# EAGLE design basspre (EAGLE 6.6.0)
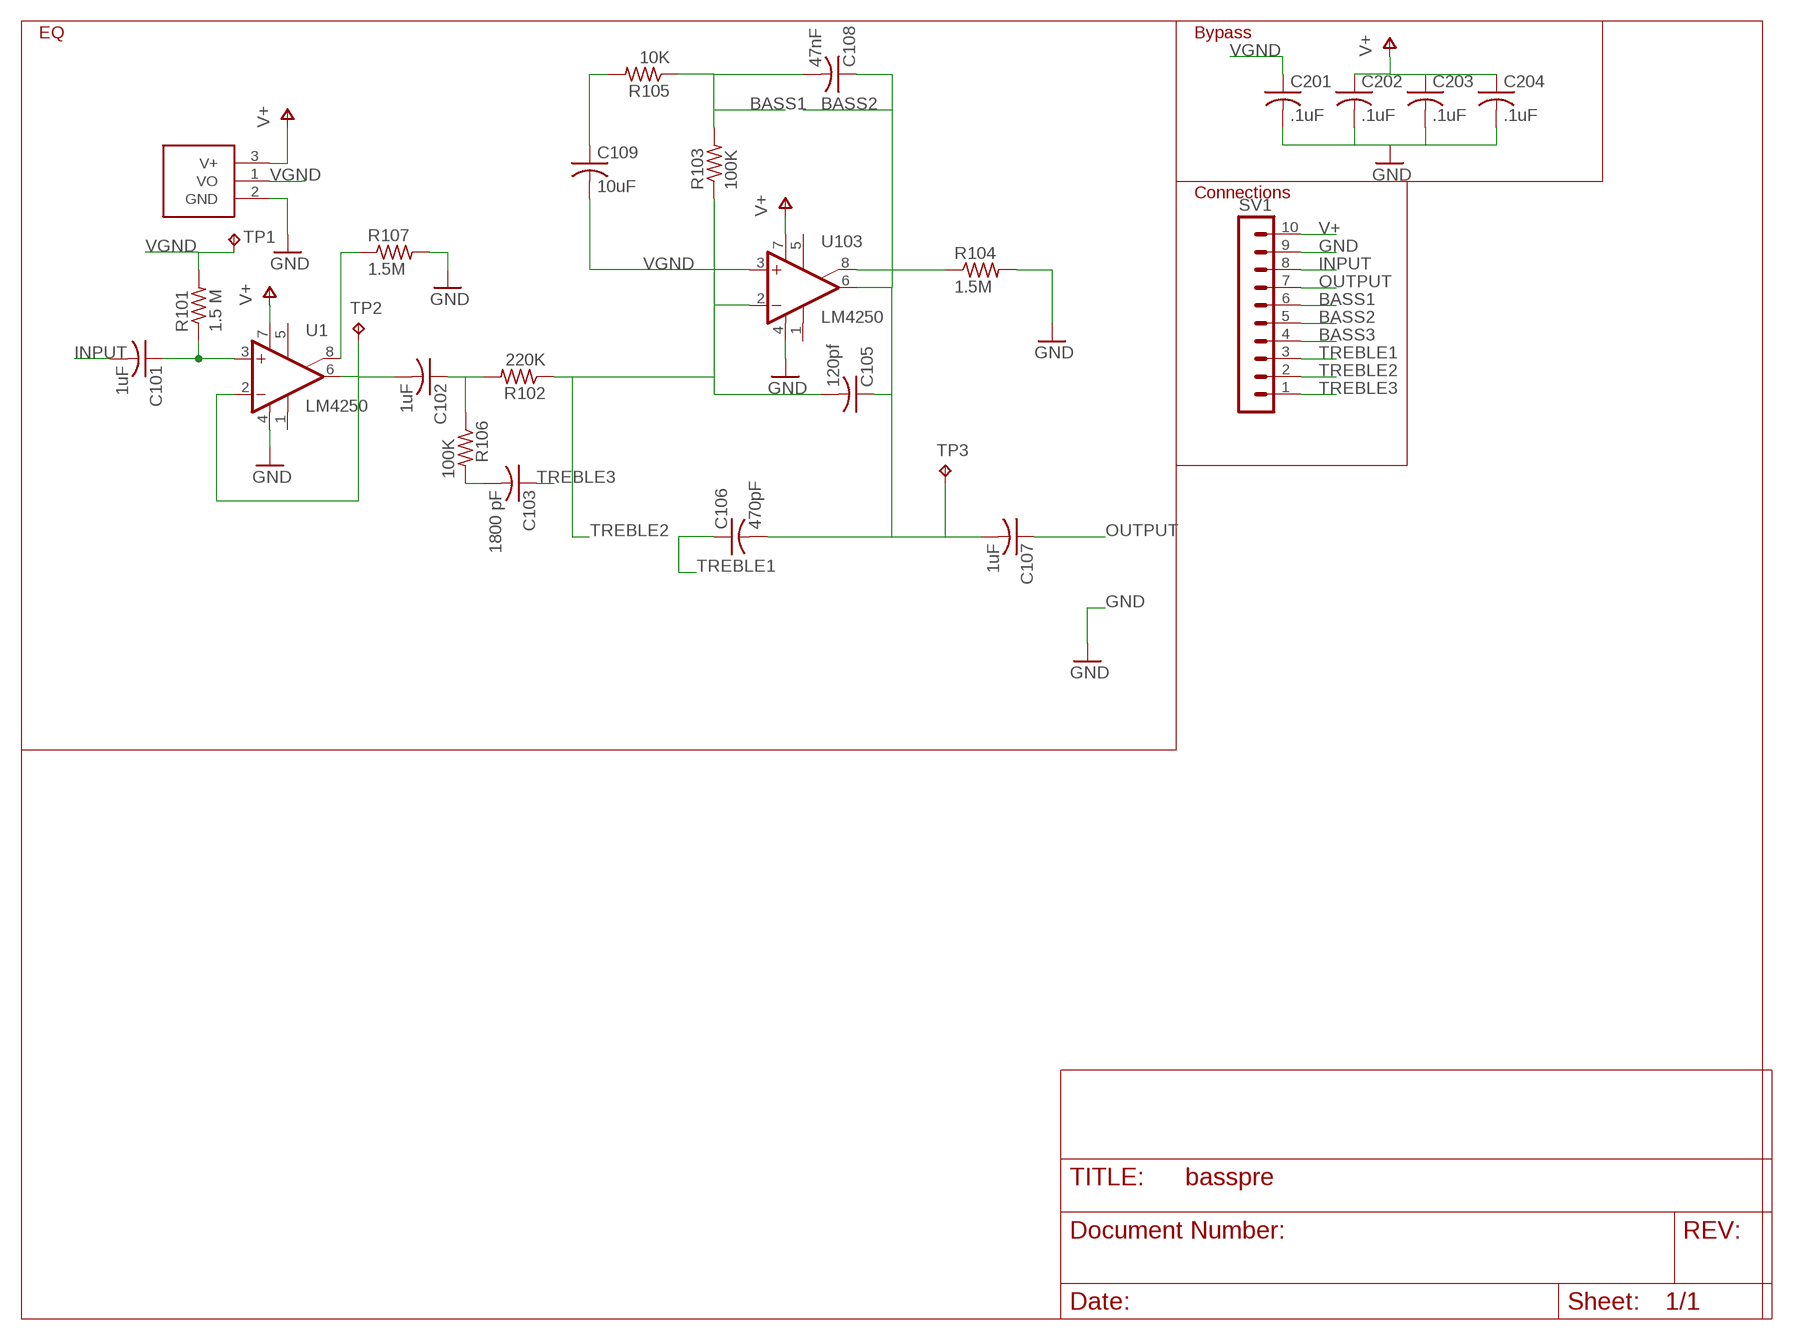
[diagram p0: schematic, sheet 1]

## Parts
C101  1uF  C-USC0805  [C0805]
C102  1uF  C-USC0805  [C0805]
C103  1800 pF  C-USC0603  [C0603]
C105  120pf  C-USC0603  [C0603]
C106  470pF  C-USC0603  [C0603]
C107  1uF  C-USC0805  [C0805]
C108  47nF  C-USC0603  [C0603]
C109  10uF  C-USC0805  [C0805]
C201  .1uF  C-USC0603  [C0603]
C202  .1uF  C-USC0603  [C0603]
C203  .1uF  C-USC0603  [C0603]
C204  .1uF  C-USC0603  [C0603]
R101  1.5 M  R-US_R0603  [R0603]
R102  220K  R-US_R0603  [R0603]
R103  100K  R-US_R0603  [R0603]
R104  1.5M  R-US_R0603  [R0603]
R105  10K  R-US_R0603  [R0603]
R106  100K  R-US_R0603  [R0603]
R107  1.5M  R-US_R0603  [R0603]
SV1  MA10-1  [MA10-1]
TP1  TPPAD1-13  [P1-13]
TP2  TPPAD1-13  [P1-13]
TP3  TPPAD1-13  [P1-13]
U1  LM4250  [SOIC8]
U101  TLE2426IDR  [SOIC8]
U103  LM4250  [SOIC8]

## Nets
BASS1: C108.2 R103.2 R105.1 SV1.6
BASS2: C105.1 C106.2 C107.2 C108.1 SV1.5 TP3.TP U103.6(OUT)
BASS3: SV1.4
C1: C101.1 R101.1 U1.3(+IN)
GND: C201.2 C202.2 C203.2 C204.2 R104.2 R107.2 SV1.9 U1.4(V-) U101.2(GND) U103.4(V-)
INPUT: C101.2 SV1.8
N$1: C102.1 R102.2 R106.1
N$2: R104.1 U103.8(CURRENT)
N$3: C102.2 TP2.TP U1.2(-IN) U1.6(OUT)
N$4: C109.1 R105.2
N$5: C103.2 R106.2
OUTPUT: C107.1 SV1.7
R107: R107.1 U1.8(CURRENT)
TREBLE1: C106.1 SV1.3
TREBLE2: C105.2 R102.1 R103.1 SV1.2 U103.2(-IN)
TREBLE3: C103.1 SV1.1
V+: C202.1 C203.1 C204.1 SV1.10 U1.7(V+) U101.3(V+) U103.7(V+)
VGND: C109.2 C201.1 R101.2 TP1.TP U101.1(VO) U103.3(+IN)
Unconnected: U1.1(OFF-) U1.5(OFF) U103.1(OFF-) U103.5(OFF)

## Notes on the sheet
- EQ | Bypass
- Connections

## Library data of the parts
C101 C102 C107 C109 = rcl:C-US: CAPACITOR, American symbol
C103 C105 C106 C108 C201-C204 = resistor:C-US: CAPACITOR, American symbol
R101-R107 = resistor:R-US_: RESISTOR, American symbol
SV1 = con-lstb:MA10-1: PIN HEADER; OC_FARNELL: unknown; OC_NEWARK: unknown
TP1-TP3 = testpad:TP: Test pad
U1 U103 = russell_random:LM4250
U101 = russell_random:TLE2426IDR

## Board
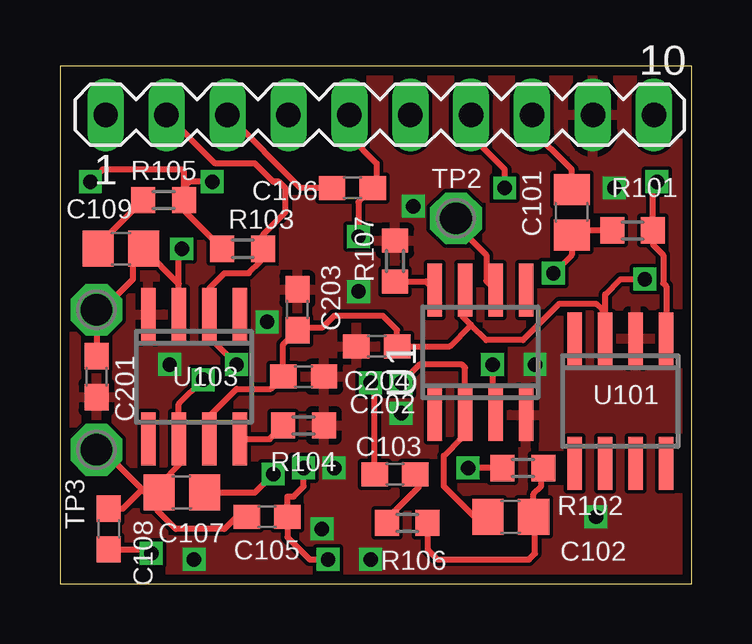
[diagram p1: board, top side]
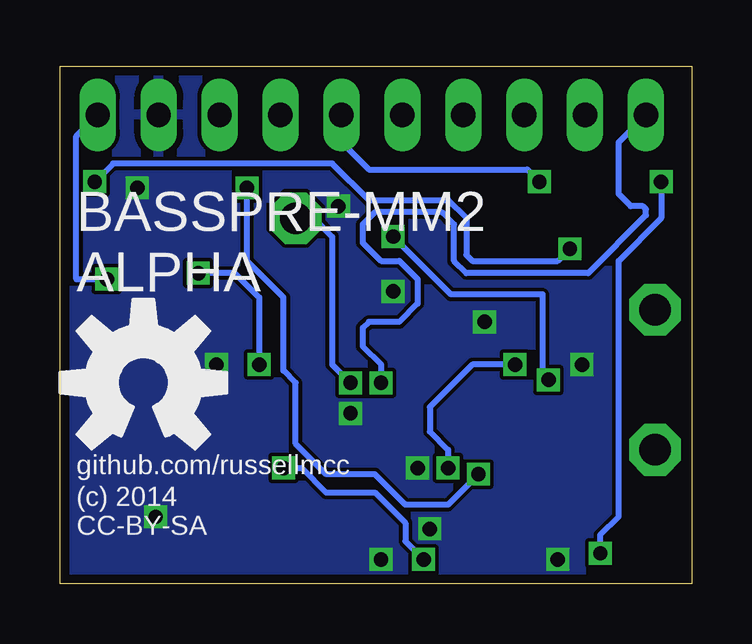
[diagram p2: board, bottom side, seen from below]

Size 26.34 x 21.58 mm. Coordinates in mm from the lower left corner, seen from the top.
Outline: 0,0 26.34,0 26.34,21.58 0,21.58 0,0
Copper layers (1*16): Top 0.0356mm / dielectric 1.5011mm / Bottom 0.0356mm
Design rules "LaenPCBOrder *": minimum track width 6mil, minimum drill 13mil, track to track 6mil, track to pad 6mil, pad to pad 6mil, via to via 6mil, smd to smd 6mil, copper to edge 15mil, drill to drill 6mil, minimum pad ring 7mil, minimum via ring 7mil, stop-mask expansion 3mil, vias tented up to drill 25mil, thermal gap 10mil

### Footprints (pad centres in the part's own frame; a part is rotated, then mirrored left to right if it is on the bottom)
C0805 = smd 1.3 x 1.5: 1 -0.95,0; 2 0.95,0
C0603 = smd 1.1 x 1: 1 -0.85,0; 2 0.85,0
R0603 = smd 1 x 1.1: 1 -0.85,0; 2 0.85,0
MA10-1 = drill 1.016 long: 1 -11.43,0; 2 -8.89,0; 3 -6.35,0; 4 -3.81,0; 5 -1.27,0; 6 1.27,0; 7 3.81,0; 8 6.35,0; 9 8.89,0; 10 11.43,0
P1-13 = drill 1.321 pad 2.159 octagon: TP 0,0
SOIC8 = smd 0.6 x 2.2: 1 -1.905,-2.6; 2 -0.635,-2.6; 3 0.635,-2.6; 4 1.905,-2.6; 5 1.905,2.6; 6 0.635,2.6; 7 -0.635,2.6; 8 -1.905,2.6

### Placement (x,y rotation side)
C101  21.34,15.49 90 top
C102  18.8,2.79 180 top
C103  13.97,4.57 0 top
C105  8.64,2.79 0 top
C106  12.19,16.51 0 top
C107  5.08,3.81 180 top
C108  2.03,2.29 270 top
C109  2.54,13.97 0 top
C201  1.52,8.64 270 top
C202  10.16,8.64 0 top
C203  9.91,11.43 90 top
C204  13.21,9.91 180 top
R101  23.88,14.73 0 top
R102  19.3,4.83 0 top
R103  7.62,13.97 180 top
R104  10.16,6.6 0 top
R105  4.32,16 180 top
R106  14.48,2.54 180 top
R107  13.97,13.46 90 top
SV1  13.34,19.56 0 top
TP1  1.52,11.43 0 top
TP2  16.51,15.24 0 top
TP3  1.52,5.59 0 top
U1  17.53,9.65 0 top
U101  23.37,7.62 180 top
U103  5.59,8.64 180 top
U$1  [OSHW-LOGO-L]  22.86,8.38 0 bottom

### Tracks (layer width: path | path; a pad name or v marks a point on that pad's centre or on a via)
BASS1  (via drill 0.6)
  Top 0.254: C108.2 3.64,1.44 v3.81,1.27 | 5.17,16.51 R105.1 5.17,15.57 R103.2 | 5.17,16.51 5.17,17.18 5.08,17.27 1.78,17.27 v1.27,16.76 | v6.35,16.76 5.42,16.76 5.17,16.51
  Bottom 0.254: SV1.6 14.48,19.43 14.48,18.29 13.46,17.27 6.86,17.27 v6.35,16.76 | v3.81,1.27 3.81,2.03 3.05,2.79 3.05,13.46 1.27,15.24 v1.27,16.76
BASS2  (via drill 0.6)
  Top 0.254: C107.2 3.56,3.81 3.43,3.94 | 3.43,3.94 2.03,5.33 1.52,5.33 TP3.TP | C107.2 4.13,4.13 5.08,5.08 5.08,5.66 U103.6 4.95,7.49 v5.97,8.51 | SV1.5 12.06,18.67 13.21,17.53 13.21,16.68 C106.2 12.45,15.91 v12.45,14.48 | C108.1 2.63,3.14 3.43,3.94 | C105.1 7.37,2.79 6.86,2.29 4.83,2.29 4.06,3.05 4.06,3.74 C107.2
  Bottom 0.254: v5.97,8.51 6.22,8.76 6.22,12.06 10.03,12.06 v12.45,14.48
C1  (via drill 0.6)
  Top 0.254: v18.03,9.14 18.03,7.18 U1.3 | R101.1 21.52,14.73 C101.1 21.34,13.72 v20.57,12.95
  Bottom 0.254: v18.03,9.14 18.03,11.94 19.05,12.95 v20.57,12.95
GND  (via drill 0.6)
  other vias: 14.73,15.75 19.81,9.14 5.59,1.02 10.92,2.29 4.57,9.14 23.11,16.51 12.45,12.19 14.22,7.11 22.35,2.79 12.95,1.02 11.43,4.83 8.64,10.92
  pour Bottom: 0,21.59 26.67,21.59 26.67,0 0,0
  pour Top: 0,21.59 26.67,21.59 26.67,0 0,0
INPUT
  Top 0.254: C101.2 21.34,17.27 19.56,19.05 19.56,19.43 SV1.8
N$1
  Top 0.254: R106.1 15.33,1.44 15.75,1.02 19.56,1.02 19.81,1.27 19.81,2.73 C102.1 19.75,3.74 20.07,4.06 20.07,4.74 R102.2
N$2
  Top 0.254: U103.8 8.74,6.04 R104.1
N$3  (via drill 0.6)
  Top 0.254: TP2.TP 16.51,14.99 17.78,13.72 17.78,12.63 U1.6 | v14.22,8.38 14.99,9.14 16.76,9.14 16.89,9.02 U1.2 16.76,6.92 16.76,6.1 16,5.33 16,4.06 17.27,2.79 C102.2
  Bottom 0.254: TP2.TP 15.75,15.24 14.99,14.48 14.99,9.14 v14.22,8.38
N$4
  Top 0.254: 1.44,14.12 C109.1 1.59,14.12 R105.2
N$5
  Top 0.254: R106.2 13.63,2.71 14.99,4.06 14.99,4.41 C103.2
OUTPUT  (via drill 0.6)
  Top 0.254: C107.1 8.13,3.81 v8.89,4.57 | v18.54,16.51 18.54,17.27 17.27,18.54 17.27,19.43 SV1.7
  Bottom 0.254: v8.89,4.57 10.16,3.3 11.94,3.3 13.21,4.57 15.24,4.57 16.51,5.84 16.51,8.38 17.02,8.89 17.02,11.94 18.54,13.46 v18.54,16.51
R107
  Top 0.254: R107.1 15.26,12.61 U1.8
TREBLE1
  Top 0.254: C106.1 10.03,16.51 SV1.3
TREBLE2  (via drill 0.6)
  Top 0.254: R102.1 v17.02,4.83 | v7.37,9.14 6.1,10.41 6.1,11.11 U103.2 6.22,12.32 6.86,12.95 7.87,12.95 8.38,13.46 8.38,13.88 R103.1 8.47,14.57 9.4,15.49 9.4,16.51 9.14,16.76 8.89,16.76 8.13,17.53 6.48,17.53 SV1.2 | v11.18,1.02 10.41,1.02 9.49,1.94 C105.2 9.49,3.64 9.74,3.64 10.16,4.06 v10.16,4.83
  Bottom 0.254: v7.37,9.14 9.14,9.14 10.92,7.37 10.92,6.35 10.16,5.59 v10.16,4.83 | v17.02,4.83 16.26,4.83 15.24,3.81 13.21,3.81 11.94,2.54 11.94,1.78 v11.18,1.02
TREBLE3  (via drill 0.6)
  Top 0.254: C103.1 13.12,8.22 v12.95,8.38
  Bottom 0.254: v12.95,8.38 12.95,9.14 13.72,9.91 13.72,10.67 13.46,10.92 12.19,10.92 11.43,11.68 11.43,12.7 12.19,13.46 12.95,13.46 13.72,14.22 13.72,14.99 13.21,15.49 10.41,15.49 9.91,14.99 9.91,13.46 9.4,12.95 4.32,12.95 1.91,15.37 1.91,15.62 2.03,15.75 2.54,15.75 3.05,16.26 3.05,18.41 SV1.1
V+  (via drill 0.6)
  Top 0.254: U103.7 6.22,6.99 7.37,8.13 8.8,8.13 C202.1 9.31,9.98 C203.1 9.99,10.67 10.92,10.67 11.43,11.18 13.46,11.18 14.06,10.58 C204.1 16.26,9.91 17.14,10.79 | 17.14,10.79 17.78,10.16 19.3,10.16 20.83,11.68 22.35,11.68 22.61,11.43 22.61,10.35 U101.3 22.73,12.06 23.37,12.7 v24.38,12.7 | 17.14,10.79 16.76,11.18 16.76,12.12 U1.7
  Bottom 0.254: SV1.10 25.65,18.67 25.65,12.7 v24.38,12.7
VGND  (via drill 0.6)
  Top 0.254: C201.1 TP1.TP 1.78,11.43 3.05,12.7 3.05,13.53 C109.2 4.95,12.51 | U103.3 4.95,12.51 | 4.95,12.51 4.95,13.84 v5.08,13.97 | v24.89,16.76 24.73,16.6 R101.2 24.73,14.14 25.15,13.72 25.15,12.53 25.27,12.41 U101.1
  Bottom 0.254: v24.89,16.76 24.13,17.53 14.99,17.53 13.46,16 10.16,16 9.4,15.24 9.4,13.72 9.14,13.46 5.59,13.46 v5.08,13.97

### Text on the board
bPlace: BASSPRE-MM2 / ALPHA | github.com/russellmcc | (c) 2014 / CC-BY-SA